# Altium project mag_encoder.PrjPcb
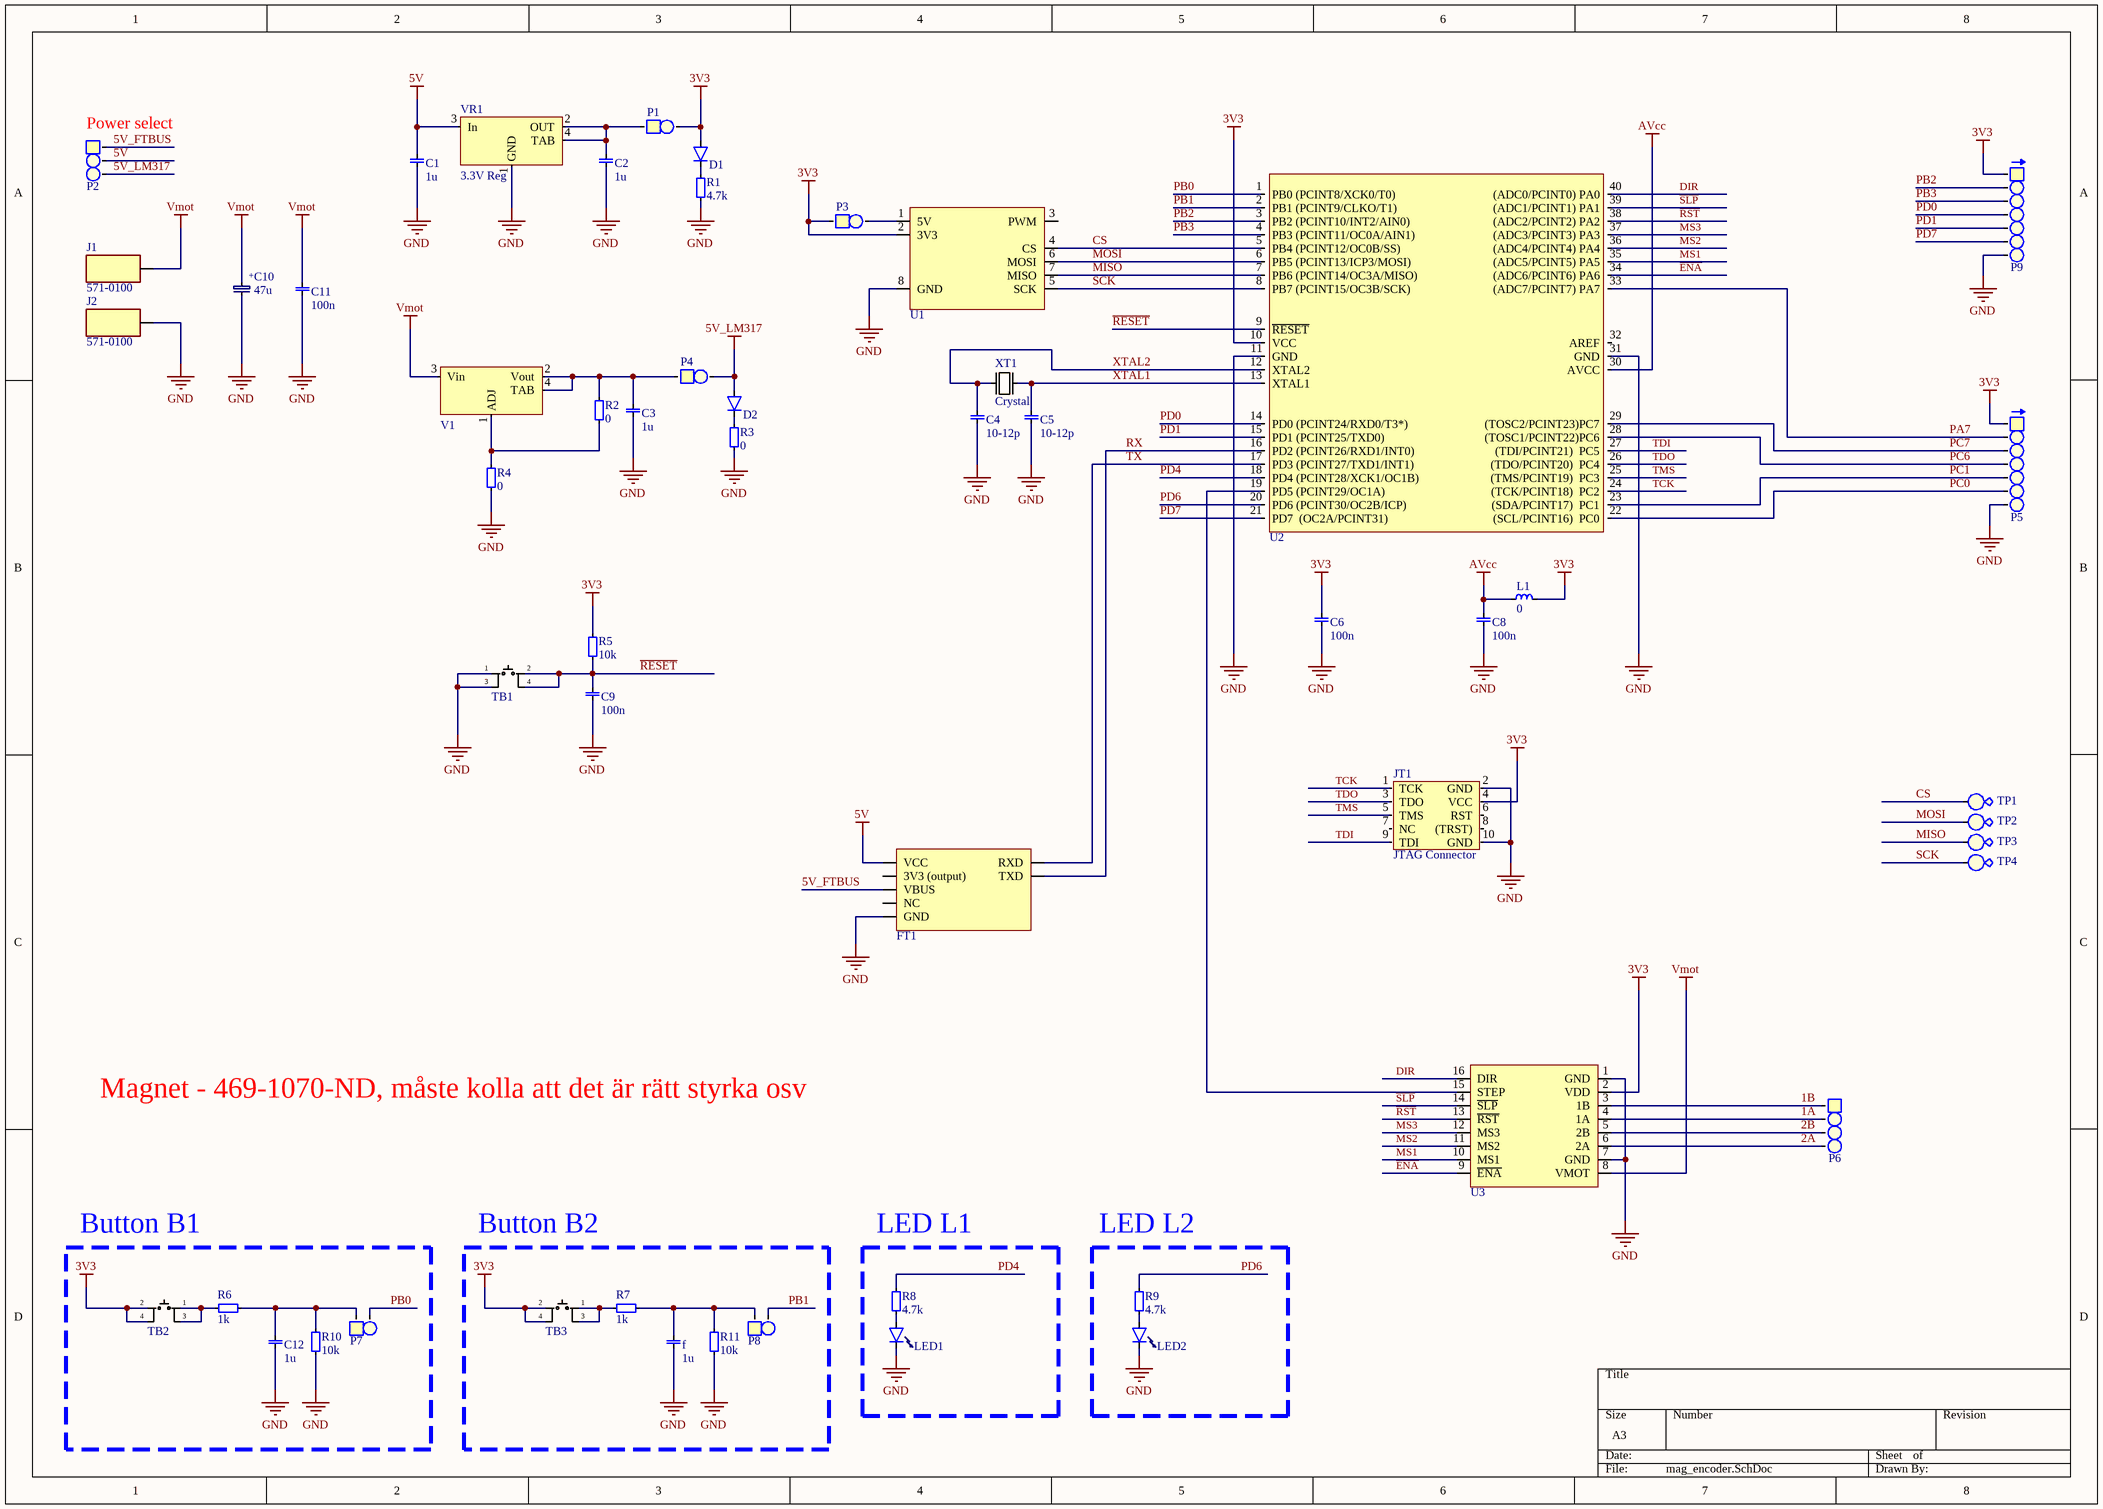
[diagram p0: mag_encoder.SchDoc]
1 sheet, 54 parts. Net scope: global (net labels, ports and power ports of the same name join across sheets).
Board file: mag_encoder.PcbDoc

## Sheet mag_encoder.SchDoc
size A3

### Parts
C1  value 1u  [0603 cap]  (hidden comment: 0603, capacitor)
C2  value 1u  [0603 cap]  (hidden comment: 0603, capacitor)
C3  value 1u  [0603 cap]  (hidden comment: 0603, capacitor)
C4  value 10-12p  [0603 cap]  (hidden comment: 0603, capacitor)
C5  value 10-12p  [0603 cap]  (hidden comment: 0603, capacitor)
C6  value 100n  [0603 cap]  (hidden comment: 0603, capacitor)
C8  value 100n  [0603 cap]  (hidden comment: 0603, capacitor)
C9  value 100n  [0603 cap]  (hidden comment: 0603, capacitor)
C10  value 47u  [CASE_B]  (hidden comment: Cap, case B)
C11  value 100n  [0805, cap]  (hidden comment: 0805, capacitor)
C12  value 1u  [0603 cap]  (hidden comment: 0603, capacitor)
D1  0805, diode  [0805 diode]  (value not drawn)
D2  0805, diode  [0805 diode]  (value not drawn)
f  value 1u  [0603 cap]  (hidden comment: 0603, capacitor)
FT1  FT232_pcb  [ft2323_pcb]  (value not drawn)
J1  571-0100  [Banana Conn VCC]
J2  571-0100  [Banana Conn GND]
JT1  JTAG Connector  [Atmel_JTAG]
L1  value 0  [1812, coil]  (hidden comment: Coil)
LED1  0805, LED  [0805_led]  (value not drawn)
LED2  0805, LED  [0805_led]  (value not drawn)
P1  1x2 Pin Header Straight  [padtwo_L]  (value not drawn)
P2  1x3 Pin Header  [padThree_L]  (value not drawn)
P3  1x2 Pin Header Straight  [padtwo_L]  (value not drawn)
P4  1x2 Pin Header Straight  [padtwo_L]  (value not drawn)
P5  1x7 Pin Header  [1x7 Pin Header]  (value not drawn)
P6  4x1 Pin Header  [padFour_L]  (value not drawn)
P7  1x2 Pin Header  [1x2HEADER]  (value not drawn)
P8  1x2 Pin Header  [1x2HEADER]  (value not drawn)
P9  1x7 Pin Header  [1x7 Pin Header]  (value not drawn)
R1  value 4.7k  [0603]  (hidden comment: 0603, resistor)
R2  value 0  [0603]  (hidden comment: 0603, resistor)
R3  value 0  [0603]  (hidden comment: 0603, resistor)
R4  value 0  [0603]  (hidden comment: 0603, resistor)
R5  value 10k  [0603]  (hidden comment: 0603, resistor)
R6  value 1k  [0603]  (hidden comment: 0603, resistor)
R7  value 1k  [0603]  (hidden comment: 0603, resistor)
R8  value 4.7k  [0603]  (hidden comment: 0603, resistor)
R9  value 4.7k  [0603]  (hidden comment: 0603, resistor)
R10  value 10k  [0603]  (hidden comment: 0603, resistor)
R11  value 10k  [0603]  (hidden comment: 0603, resistor)
TB1  Tactile Button  [Button smd]  (value not drawn)
TB2  Tactile Button  [Button smd]  (value not drawn)
TB3  Tactile Button  [Button smd]  (value not drawn)
TP1  Test Point  [testPoint]  (value not drawn)
TP2  Test Point  [testPoint]  (value not drawn)
TP3  Test Point  [testPoint]  (value not drawn)
TP4  Test Point  [testPoint]  (value not drawn)
U1  as5048_module  [AS5048_MODULE]  (value not drawn)
U2  ATmega1284  [DIP40]  (value not drawn)
U3  A4988_stepstick  [A4988_stepstick]  (value not drawn)
V1  LM317  [SOT223]  (value not drawn)
VR1  3.3V Reg  [SOT223]
XT1  value Crystal  [XTAL_SMD_LP]  (hidden comment: XTAL TXC 7A)

### Blocks framed on the sheet
Button B1: C12 P7 R6 R10 TB2
Button B2: f P8 R7 R11 TB3
LED L1: LED1 R8
LED L2: LED2 R9

### Nets
3V3: C6.1 D1.1 JT1.4(VCC) L1.1 P1.2 P3.1 P5.1 P9.1 R5.0 TB2.2 TB2.4 TB3.2 TB3.4 U1.2(3V3) U2.10(VCC) U3.2(VDD)
5V: C1.1 FT1.1(VCC) P2.2 VR1.3(In)
5V_LM317: D2.1 P2.3 P4.2
AVcc: C8.1 L1.2 U2.30(AVCC)
GND: C1.0 C2.0 C3.0 C4.0 C5.0 C6.0 C8.0 C9.0 C10.1 C11.0 C12.0 f.0 FT1.7(GND) J2.1 JT1.2(GND) JT1.10(GND) LED1.0(Cathode) LED2.0(Cathode) P5.7 P9.7 R1.1 R3.1 R4.1 R10.1 R11.1 TB1.1 TB1.3 U1.8(GND) U2.11(GND) U2.31(GND) U3.1(GND) U3.7(GND) VR1.1(GND)
Vmot: C10.2 C11.1 J1.1 U3.8(VMOT) V1.3(Vin)
1A: P6.2 U3.4(1A)
1B: P6.1 U3.3(1B)
2A: P6.4 U3.6(2A)
2B: P6.3 U3.5(2B)
5V_FTBUS: FT1.3(VBUS) P2.1
CS: TP1.0 U1.4(CS) U2.5(PB4_(PCINT12/OC0B/SS))
DIR: U2.40((ADC0/PCINT0)_PA0) U3.16(DIR)
~{ENA}: U2.34((ADC6/PCINT6)_PA6) U3.9(~{ENA})
MISO: TP3.0 U1.7(MISO) U2.7(PB6_(PCINT14/OC3A/MISO))
MOSI: TP2.0 U1.6(MOSI) U2.6(PB5_(PCINT13/ICP3/MOSI))
MS1: U2.35((ADC5/PCINT5)_PA5) U3.10(MS1)
MS2: U2.36((ADC4/PCINT4)_PA4) U3.11(MS2)
MS3: U2.37((ADC3/PCINT3)_PA3) U3.12(MS3)
PA7: P5.2 U2.33((ADC7/PCINT7)_PA7)
PB0: P7.2 U2.1(PB0_(PCINT8/XCK0/T0))
PB1: P8.2 U2.2(PB1_(PCINT9/CLKO/T1))
PB2: P9.2 U2.3(PB2_(PCINT10/INT2/AIN0))
PB3: P9.3 U2.4(PB3_(PCINT11/OC0A/AIN1))
PC0: P5.6 U2.22((SCL/PCINT16)__PC0)
PC1: P5.5 U2.23((SDA/PCINT17)__PC1)
PC6: P5.4 U2.28((TOSC1/PCINT22)PC6)
PC7: P5.3 U2.29((TOSC2/PCINT23)PC7)
PD0: P9.4 U2.14(PD0_(PCINT24/RXD0/T3*))
PD1: P9.5 U2.15(PD1_(PCINT25/TXD0))
PD4: R8.0 U2.18(PD4_(PCINT28/XCK1/OC1B))
PD6: R9.0 U2.20(PD6_(PCINT30/OC2B/ICP))
PD7: P9.6 U2.21(PD7__(OC2A/PCINT31))
~{RESET}: C9.1 R5.1 TB1.2 TB1.4 U2.9(~{RESET})
~{RST}: U2.38((ADC2/PCINT2)_PA2) U3.13(~{RST})
RX: FT1.4(TXD) U2.16(PD2_(PCINT26/RXD1/INT0))
~{SLP}: U2.39((ADC1/PCINT1)_PA1) U3.14(~{SLP})
SCK: TP4.0 U1.5(SCK) U2.8(PB7_(PCINT15/OC3B/SCK))
TCK: JT1.1(TCK) U2.24((TCK/PCINT18)__PC2)
TDI: JT1.9(TDI) U2.27((TDI/PCINT21)__PC5)
TDO: JT1.3(TDO) U2.26((TDO/PCINT20)__PC4)
TMS: JT1.5(TMS) U2.25((TMS/PCINT19)__PC3)
TX: FT1.5(RXD) U2.17(PD3_(PCINT27/TXD1/INT1))
XTAL1: C5.1 U2.13(XTAL1) XT1.1
XTAL2: C4.1 U2.12(XTAL2) XT1.2
NetC2_1: C2.1 P1.1 VR1.2(OUT) VR1.4(TAB)
NetC3_1: C3.1 P4.1 R2.0 V1.2(Vout) V1.4(TAB)
NetC12_1: C12.1 P7.1 R6.0 R10.0
NetD1_0: D1.0(Cathode) R1.0
NetD2_0: D2.0(Cathode) R3.0
Netf_1: f.1 P8.1 R7.0 R11.0
NetLED1_1: LED1.1 R8.1
NetLED2_1: LED2.1 R9.1
NetP3_2: P3.2 U1.1(5V)
NetR2_1: R2.1 R4.0 V1.1(ADJ)
NetR6_1: R6.1 TB2.1 TB2.3
NetR7_1: R7.1 TB3.1 TB3.3
NetU2_19: U2.19(PD5_(PCINT29/OC1A)) U3.15(STEP)

Not connected (* = marked no-connect by the designer): FT1 2(3V3_(output)) 6(NC); JT1 6(RST) 7(NC) 8((TRST)); U1 3(PWM); U2 32(AREF)

### Notes on the sheet
- (near P2) Power select
- Magnet - 469-1070-ND, måste kolla att det är rätt styrka osv
- (in symbol Cap, case B) +

### Library data of the parts
J1 J2 = Banana conn: Banana Connector 571-0100; Manufacturer_Name: Deltron; Datasheet Link: https://www.dem-uk.com/deltron-components/Data/Product_Downloads/deltron-571-0100-4mm-90deg-single-socket-data.pdf; Height: 12.4mm; Manufacturer_Part_Number: 571-0100; Mouser Part Number: 164-6218; Mouser Price/Stock: https://www.mouser.com/Search/Refine.aspx?Keyword=164-6218
JT1 = Atmel JTAG: Atmel JTAG Connector
LED1 LED2 = 0805, LED: Value: 0805 LED; Farnell: 8529930
P1 P3 P4 = 1x2 Pin Header Straight: 2.54 mm, TH; Value: 1x2 Pin Header
P2 = 1x3 Pin Header: 2.54 mm; Value: 1x3 Pin Header
P5 P9 = 1x7 Pin Header: 2.54 mm; Value: 1x8 Pin Header
P6 = 1x4 Pin Header: 2.54 mm; Value: 4x1 Pin Header
P7 P8 = 1x2 Pin Header: 2.54 mm, TH; Value: 1x2 Pin Header
TB1-TB3 = Button SMD: Tactile Switch Small Low; ELFA: 110-87-406; Value: Button SMD; Farnell: 2320087
U1 = as5048_module: AS5048 Rotary encoder
U2 = ATmega1284: 8-bit Atmel Microcontroller with 128K Bytes  In-System Programmable Flash; Value: ATmega1284
V1 = LM317 SOT223: Adjustable Voltage Regulator; Value: LM317; Farnell: 1469023
VR1 = TLV1117LV: TLV1117LV 1-A, Positive Fixed-Voltage, Low-Dropout Regulator; Value: TPS79333DBVR; Drop Out: 102mV; Farnell: 1287689
XT1 = XTAL TXC 7A: 16 MHz, SMD, 5mm x 3,2mm, 30 ppm; Farnell: 1841946
TP1-TP4 = Test Point: Value: Test point; Farnell: 1702006